# Altium project Nexsat-2.PrjPcb
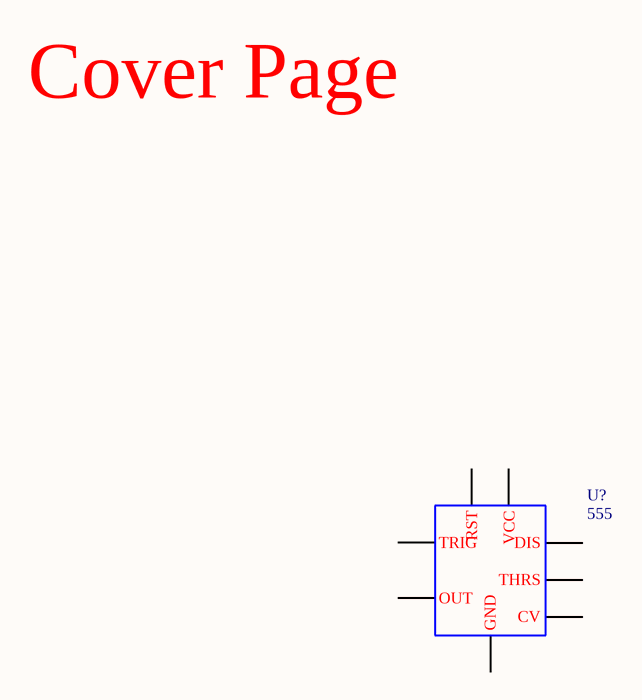
[diagram p0: Coverpage.SchDoc]
2 sheets, 1 parts. Net scope: global (net labels, ports and power ports of the same name join across sheets).
Board file: Nexsat-2_V1I1.PcbDoc
Sheets:
  Coverpage.SchDoc
  second sheet.SchDoc

## Sheet Coverpage.SchDoc
size A; SheetNumber: 1; SheetTotal: 2

### Parts
U?  555

### Nets

Not connected (* = marked no-connect by the designer): U? 1(GND) 2(TRIG) 3(OUT) 4(RST) 5(CV) 6(THRS) 7(DIS) 8(VCC)

### Notes on the sheet
- Cover Page

### Library data of the parts
U? = 555: Timer 555; SimulationGenericComponent: True

## Sheet second sheet.SchDoc
size A; SheetNumber: 2; SheetTotal: 2
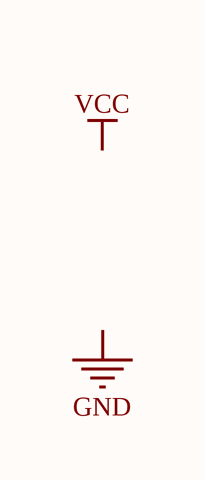
[diagram p1: second sheet.SchDoc]

### Notes on the sheet
- Labels drawn without touching a wire or pin: GND, VCC